# Altium schematic sheet Control.SchDoc
size A3; SheetNumber: 4; SheetTotal: 7
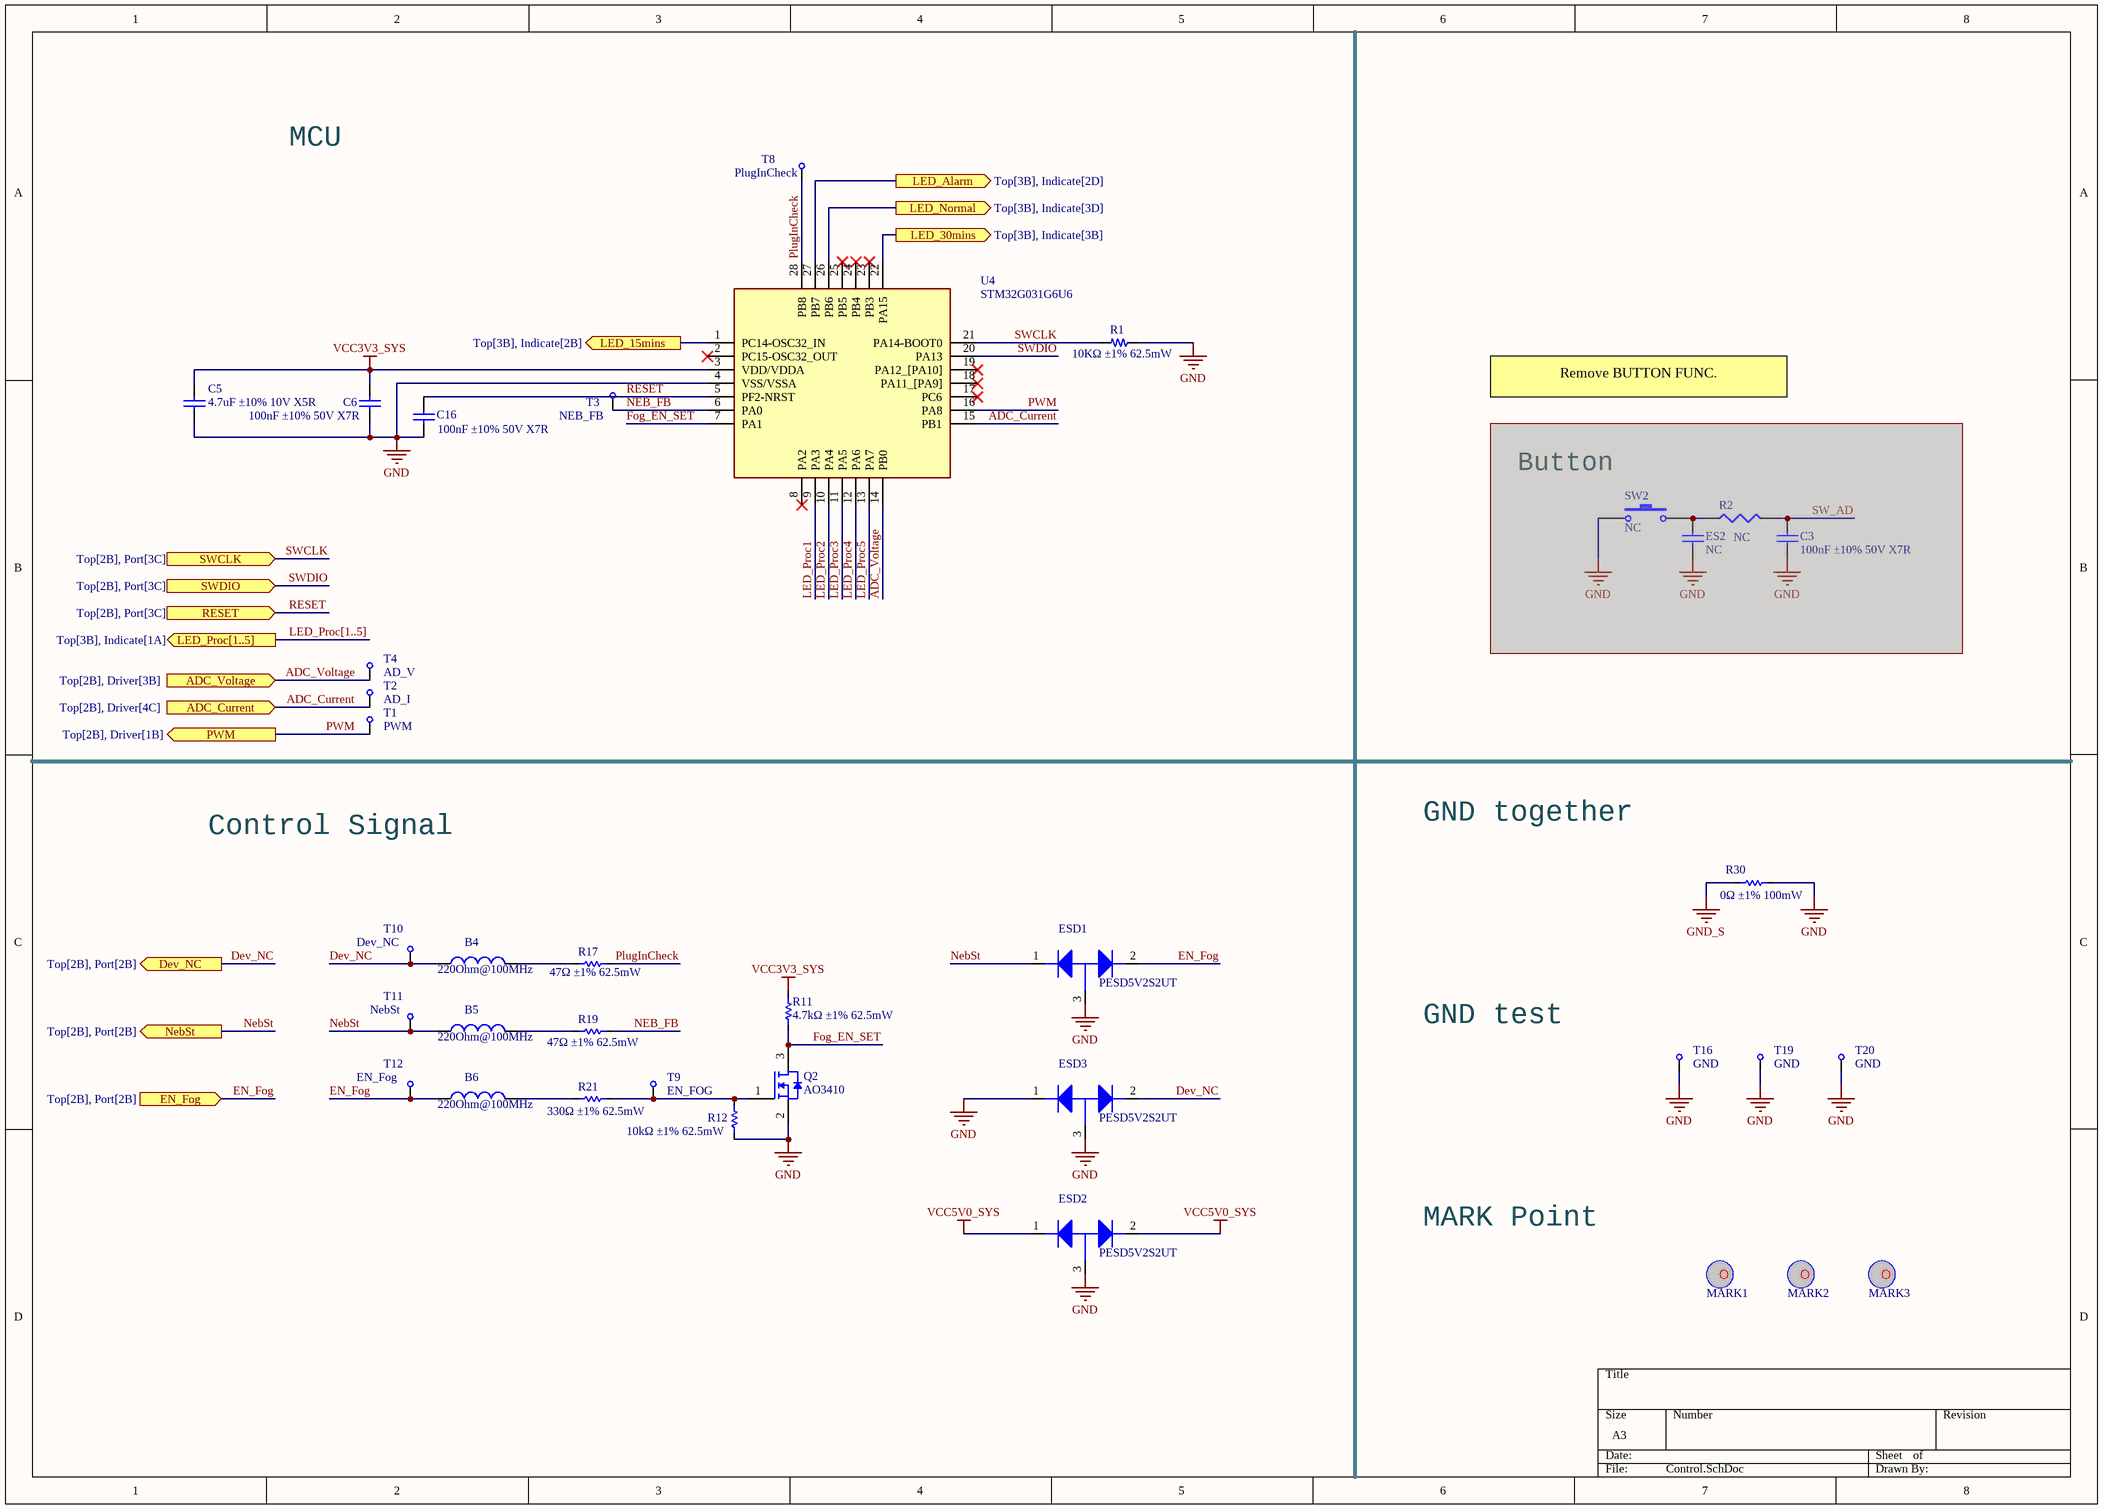
[diagram p0: Control.SchDoc]

## Parts
B4  220Ohm@100MHz  [0402-B]
B5  220Ohm@100MHz  [0402-B]
B6  220Ohm@100MHz  [0402-B]
C3  100nF ±10% 50V X7R  [C0402]  (masked out: inside a compile mask, not in the netlist)
C5  4.7uF ±10% 10V X5R  [C0402]
C6  100nF ±10% 50V X7R  [C0402]
C16  100nF ±10% 50V X7R  [C0402]
ES2  NC  [C0402]  (masked out: inside a compile mask, not in the netlist)
ESD1  PESD5V2S2UT  [SOT23]
ESD2  PESD5V2S2UT  [SOT23]
ESD3  PESD5V2S2UT  [SOT23]
MARK1  MARK_POINT  [MARK_POINT]  (value not drawn)
MARK2  MARK_POINT  [MARK_POINT]  (value not drawn)
MARK3  MARK_POINT  [MARK_POINT]  (value not drawn)
Q2  AO3410  [SOT23-3]
R1  10KΩ ±1% 62.5mW  [R0402]
R2  NC  [R0402]  (masked out: inside a compile mask, not in the netlist)
R11  4.7kΩ ±1% 62.5mW  [R0402]
R12  10kΩ ±1% 62.5mW  [R0402]
R17  47Ω ±1% 62.5mW  [R0402]
R19  47Ω ±1% 62.5mW  [R0402]
R21  330Ω ±1% 62.5mW  [R0402]
R30  0Ω ±1% 100mW  [R0603]
SW2  NC  [HTS-52MB]  (masked out: inside a compile mask, not in the netlist)
T1  PWM  [TP-SIP-1-Small1]
T2  AD_I  [TP-SIP-1-Small1]
T3  NEB_FB  [TP-SIP-1-Small1]
T4  AD_V  [TP-SIP-1-Small1]
T8  PlugInCheck  [TP-SIP-1-Small1]
T9  EN_FOG  [TP-SIP-1-Small1]
T10  Dev_NC  [TP-SIP-1-Small1]
T11  NebSt  [TP-SIP-1-Small1]
T12  EN_Fog  [TP-SIP-1-Small1]
T16  GND  [TP-SIP-1-Small1]
T19  GND  [TP-SIP-1-Small1]
T20  GND  [TP-SIP-1-Small1]
U4  STM32G031G6U6  [QFN50P400X400X60-28N-D]

## Ports
ADC_Current (in, see Top[2B], Driver[4C]), ADC_Voltage (in, see Top[2B], Driver[3B]), Dev_NC (out, see Top[2B], Port[2B]), EN_Fog (in, see Top[2B], Port[2B]), LED_15mins (out, see Top[3B], Indicate[2B]), LED_30mins (out, see Top[3B], Indicate[3B]), LED_Alarm (out, see Top[3B], Indicate[2D]), LED_Normal (out, see Top[3B], Indicate[3D]), LED_Proc[1..5] (out, see Top[3B], Indicate[1A]), NebSt (out, see Top[2B], Port[2B]), PWM (out, see Top[2B], Driver[1B]), RESET (in, see Top[2B], Port[3C]), SWCLK (in, see Top[2B], Port[3C]), SWDIO (in, see Top[2B], Port[3C])

## Nets
GND: C5.1 C6.1 C16.1 ESD1.3(G) ESD2.3(G) ESD3.1(S) ESD3.3(G) Q2.2(S) R1.1 R12.1 R30.2 T16.1 T19.1 T20.1 U4.4(VSS/VSSA)
GND_S: R30.1
VCC3V3_SYS: C5.2 C6.2 R11.2 U4.3(VDD/VDDA)
VCC5V0_SYS: ESD2.1(S) ESD2.2(S)
ADC_Current: T2.1 U4.15(PB1) ; port ADC_Current
ADC_Voltage: T4.1 U4.14(PB0) ; port ADC_Voltage
Dev_NC: B4.1 ESD3.2(S) T10.1 ; port Dev_NC
EN_Fog: B6.1 ESD1.2(S) T12.1 ; port EN_Fog
Fog_EN_SET: Q2.3(D) R11.1 U4.7(PA1)
LED_15mins: U4.1(PC14-OSC32_IN) ; port LED_15mins
LED_30mins: U4.22(PA15) ; port LED_30mins
LED_Alarm: U4.27(PB7) ; port LED_Alarm
LED_Normal: U4.26(PB6) ; port LED_Normal
LED_Proc1: U4.9(PA3)
LED_Proc2: U4.10(PA4)
LED_Proc3: U4.11(PA5)
LED_Proc4: U4.12(PA6)
LED_Proc5: U4.13(PA7)
NEB_FB: R19.2 T3.1 U4.6(PA0)
NebSt: B5.1 ESD1.1(S) T11.1 ; port NebSt
PlugInCheck: R17.2 T8.1 U4.28(PB8)
PWM: T1.1 U4.16(PA8) ; port PWM
RESET: C16.2 U4.5(PF2-NRST) ; port RESET
SWCLK: R1.2 U4.21(PA14-BOOT0) ; port SWCLK
SWDIO: U4.20(PA13) ; port SWDIO
NetB4_2: B4.2 R17.1
NetB5_2: B5.2 R19.1
NetB6_2: B6.2 R21.1
NetQ2_1: Q2.1(G) R12.2 R21.2 T9.1

Not connected (* = marked no-connect by the designer): U4 2(PC15-OSC32_OUT)* 8(PA2)* 17(PC6)* 18(PA11_[PA9])* 19(PA12_[PA10])* 23(PB3)* 24(PB4)* 25(PB5)*

## Buses and harness runs
bus LED_Proc[1..5] = port LED_Proc[1..5]

## Notes on the sheet
- MCU
- Remove BUTTON FUNC.
- (near SW2) Button
- Control Signal
- GND together
- GND test
- MARK Point

## Library data of the parts
B4-B6 = Inductor: BLM15AG221SN1D; Code_IEC: 1005; Value: 10uH; Published: 8-Jun-2000; LatestRevisionDate: 29-May-2009; LatestRevisionNote: IPC-7351 Footprint Added.; PackageReference: 0402-A; Publisher: Altium Limited; PackageDescription: Chip Inductor; Code_JEITA: 0402
C3 ES2 = Cap Semi: Capacitor (Semiconductor SIM Model); Value: 100pF; Published: 8-Jun-2000; LatestRevisionDate: 29-May-2009; LatestRevisionNote: IPC-7351 Footprint Added.; PackageReference: C1206; Publisher: Altium Limited; PackageDescription: Chip Capacitor
C5 = Cap: CL05A475KP5NRNC; Published: 8-Jun-2000; LatestRevisionDate: 17-Jul-2002; LatestRevisionNote: Re-released for DXP Platform.; PackageReference: RAD-0.3; Publisher: Altium Limited; PackageDescription: Radial Cap, Thru-Hole; 2 Leads; 0.3 in Pin Spacing
C6 C16 = Cap: CL05B104KO5NNNC; Published: 8-Jun-2000; LatestRevisionDate: 17-Jul-2002; LatestRevisionNote: Re-released for DXP Platform.; PackageReference: RAD-0.3; Publisher: Altium Limited; PackageDescription: Radial Cap, Thru-Hole; 2 Leads; 0.3 in Pin Spacing
ESD1-ESD3 = ESD
Q2 = AO3410: AOS,AO3410,SOT23-3,-55~+150°C,; 名称: N-MOS AO3410; 制造商: AOS; 详细信息: AOS,AO3410,SOT23-3,-55~+150°C,
R1 = R-0603: 0402WGF1002TCE
R2 = Res3: Resistor; Value: 4.7K; Published: 8-Jun-2000; LatestRevisionDate: 29-May-2009; LatestRevisionNote: IPC-7351 Footprint Added.; PackageReference: J1-0603; Publisher: Altium Limited; PackageDescription: Chip Resistor
R11 = R0402: 0402WGF4701TCE; Published: 8-Jun-2000; LatestRevisionDate: 17-Jul-2002; LatestRevisionNote: Re-released for DXP Platform.; PackageReference: AXIAL-0.3; Publisher: Altium Limited; PackageDescription: Axial Device, Thru-Hole; 2 Leads; 0.3 in Pin Spacing
R12 = R0402: 0402WGF1002TCE; Published: 8-Jun-2000; LatestRevisionDate: 17-Jul-2002; LatestRevisionNote: Re-released for DXP Platform.; PackageReference: AXIAL-0.3; Publisher: Altium Limited; PackageDescription: Axial Device, Thru-Hole; 2 Leads; 0.3 in Pin Spacing
R17 R19 = R0402: RC0402FR-0747RL; Published: 8-Jun-2000; LatestRevisionDate: 17-Jul-2002; LatestRevisionNote: Re-released for DXP Platform.; PackageReference: AXIAL-0.3; Publisher: Altium Limited; PackageDescription: Axial Device, Thru-Hole; 2 Leads; 0.3 in Pin Spacing
R21 = R0402: 0402WGF3300TCE; Published: 8-Jun-2000; LatestRevisionDate: 17-Jul-2002; LatestRevisionNote: Re-released for DXP Platform.; PackageReference: AXIAL-0.3; Publisher: Altium Limited; PackageDescription: Axial Device, Thru-Hole; 2 Leads; 0.3 in Pin Spacing
R30 = R0603: 0603WAF0000T5E; Published: 8-Jun-2000; LatestRevisionDate: 17-Jul-2002; LatestRevisionNote: Re-released for DXP Platform.; PackageReference: AXIAL-0.3; Publisher: Altium Limited; PackageDescription: Axial Device, Thru-Hole; 2 Leads; 0.3 in Pin Spacing
SW2 = SW-PB: Switch; Published: 24-Mar-1999; LatestRevisionDate: 17-Jul-2002; LatestRevisionNote: Re-released for DXP Platform.; PackageReference: SPST-2; Publisher: Altium Limited; PackageDescription: Switch; 2 Leads
T1-T4 T8-T12 T16 T19 T20 = TP-SIP-1-Small
U4 = STM32G031G6U6: Manufacturer_Name: STMicroelectronics; Datasheet Link: https://www.st.com/resource/en/datasheet/stm32g031c6.pdf; Height: 0.6mm; Manufacturer_Part_Number: STM32G031G6U6; Mouser Part Number: 511-STM32G031G6U6; Mouser Price/Stock: https://www.mouser.co.uk/ProductDetail/STMicroelectronics/STM32G031G6U6?qs=uwxL4vQweFPW1MMtF4vVDQ%3D%3D; Arrow Part Number: STM32G031G6U6; Arrow Price/Stock: https://www.arrow.com/en/products/stm32g031g6u6/stmicroelectronics?region=nac